# EAGLE design sesam_v2 (EAGLE 6.6.0)
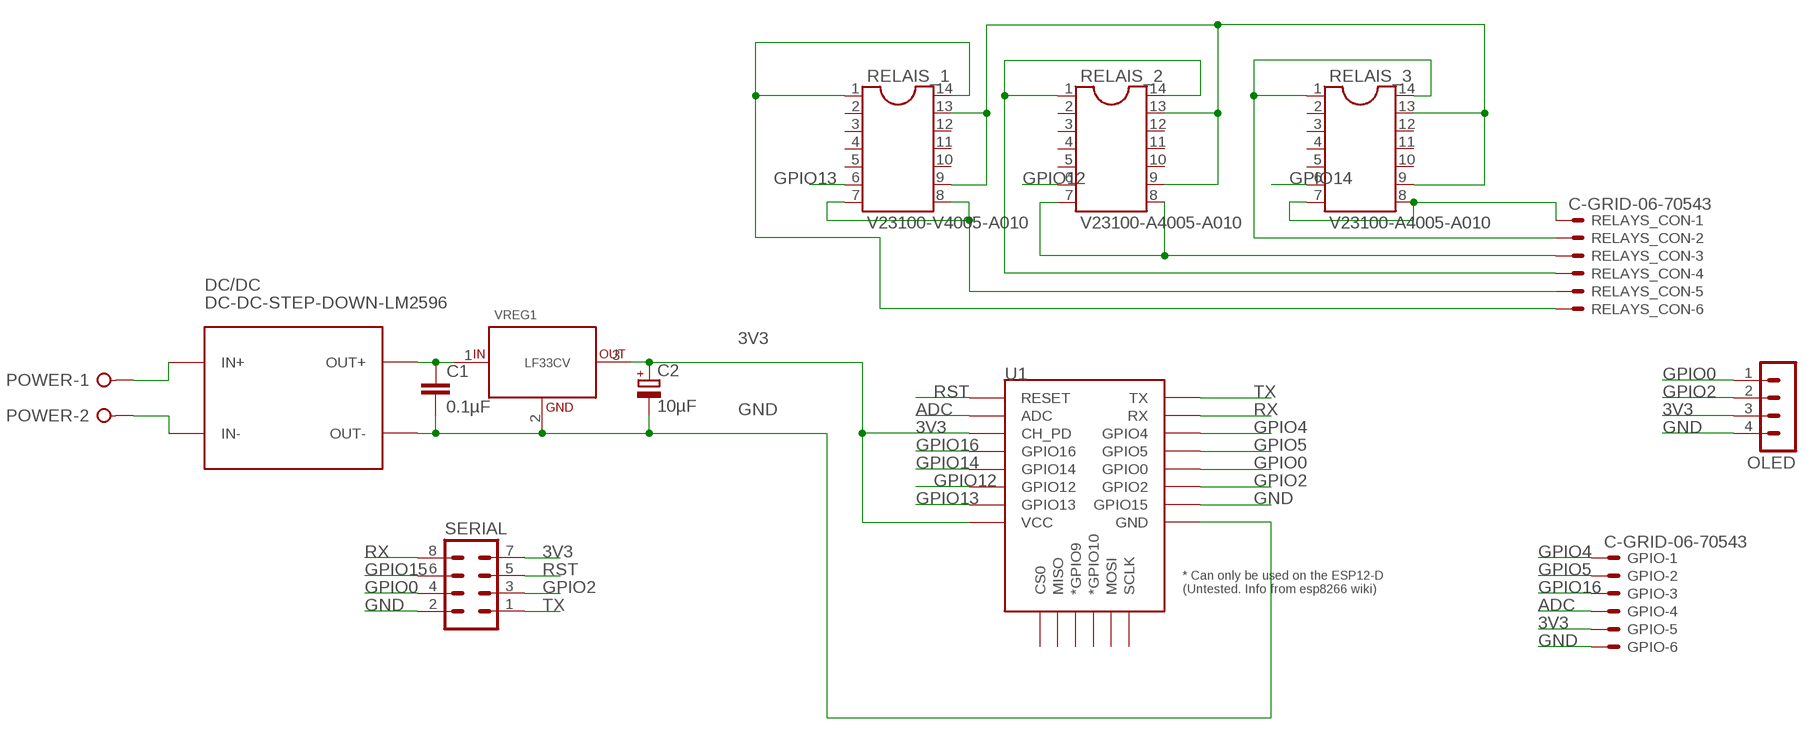
[diagram p0: schematic, sheet 1]

## Parts
C1  0.1µF  C-EUC0805  [C0805]
C2  10µF  CPOL-EUE2-5  [E2-5]
DC/DC  DC-DC-STEP-DOWN-LM2596  [DC-DC-STEP-DOWN-LM2596]
GPIO  C-GRID-06-70543  [70543-06]
OLED  MA04-1  [MA04-1]
POWER  W237-02P  [W237-132]
RELAIS_1  V23100-V4005-A010  DIL14S  [SOCKET-14]
RELAIS_2  V23100-A4005-A010  DIL14S  [SOCKET-14]
RELAIS_3  V23100-A4005-A010  DIL14S  [SOCKET-14]
RELAYS_CON  C-GRID-06-70543  [70543-06]
SERIAL  MA04-2  [MA04-2]
U1  ESP12ESMD  [ESP12E-SMD]
VREG1  LF33CV  [TO220]

## Nets
3V3: C2.+ GPIO.5 OLED.3 SERIAL.7 U1.CH_PD U1.VCC VREG1.3(OUT)
ADC: GPIO.4 U1.ADC
GND: C1.2 C2.- DC/DC.IN- DC/DC.OUT- GPIO.6 OLED.4 POWER.2 RELAIS_1.9 RELAIS_1.13 RELAIS_2.9 RELAIS_2.13 RELAIS_3.9 RELAIS_3.13 SERIAL.2 U1.GND U1.GPIO15 VREG1.2(GND)
GPIO0: OLED.1 SERIAL.4 U1.GPIO0
GPIO2: OLED.2 SERIAL.3 U1.GPIO2
GPIO4: GPIO.1 U1.GPIO4
GPIO5: GPIO.2 U1.GPIO5
GPIO12: RELAIS_2.6 U1.GPIO12
GPIO13: RELAIS_1.6 U1.GPIO13
GPIO14: RELAIS_3.6 U1.GPIO14
GPIO15: SERIAL.6
GPIO16: GPIO.3 U1.GPIO16
N$3: RELAIS_3.1 RELAIS_3.14 RELAYS_CON.2
N$4: DC/DC.IN+ POWER.1
N$5: RELAIS_3.7 RELAIS_3.8 RELAYS_CON.1
N$10: RELAIS_2.1 RELAIS_2.14 RELAYS_CON.4
N$13: RELAIS_2.7 RELAIS_2.8 RELAYS_CON.3
N$14: RELAIS_1.1 RELAIS_1.14 RELAYS_CON.6
N$15: RELAIS_1.7 RELAIS_1.8 RELAYS_CON.5
POWER: C1.1 DC/DC.OUT+ VREG1.1(IN)
RST: SERIAL.5 U1.RESET
RX: SERIAL.8 U1.RXD0(RX)
TX: SERIAL.1 U1.TXD0(TX)
Unconnected: RELAIS_1.2 RELAIS_1.3 RELAIS_1.4 RELAIS_1.5 RELAIS_1.10 RELAIS_1.11 RELAIS_1.12 RELAIS_2.2 RELAIS_2.3 RELAIS_2.4 RELAIS_2.5 RELAIS_2.10 RELAIS_2.11 RELAIS_2.12 RELAIS_3.2 RELAIS_3.3 RELAIS_3.4 RELAIS_3.5 RELAIS_3.10 RELAIS_3.11 RELAIS_3.12 U1.CS0 U1.GPIO9(*GPIO9) U1.GPIO10(*GPIO10) U1.MISO U1.MOSI U1.SCLK

## Library data of the parts
C1 = rcl:C-EU: CAPACITOR, European symbol
C2 = rcl:CPOL-EU: POLARIZED CAPACITOR, European symbol
DC/DC = diy-modules:DC-DC-STEP-DOWN-LM2596: DC/DC Step-Down Regulator based on LM2596-ADJ chip
GPIO RELAYS_CON = con-molex:C-GRID-06: CONNECTOR wire to board 2.54 mm (0.100") pitch header; OC_FARNELL: unknown; OC_NEWARK: unknown
OLED = con-lstb:MA04-1: PIN HEADER; OC_FARNELL: unknown; OC_NEWARK: unknown
POWER = con-wago-508:W237-02P: WAGO SREW CLAMP; OC_FARNELL: unknown; OC_NEWARK: unknown
RELAIS_1-RELAIS_3 = ic-package:DIL14: Dual In Line / Socket
SERIAL = con-lstb:MA04-2: PIN HEADER; OC_FARNELL: unknown; OC_NEWARK: unknown
U1 = esp8266modules:ESP12E: ESP12E Module
VREG1 = mp_vreg:LF33CV: LF33CV Low Drop 3.3V Voltage Regulator

## Board
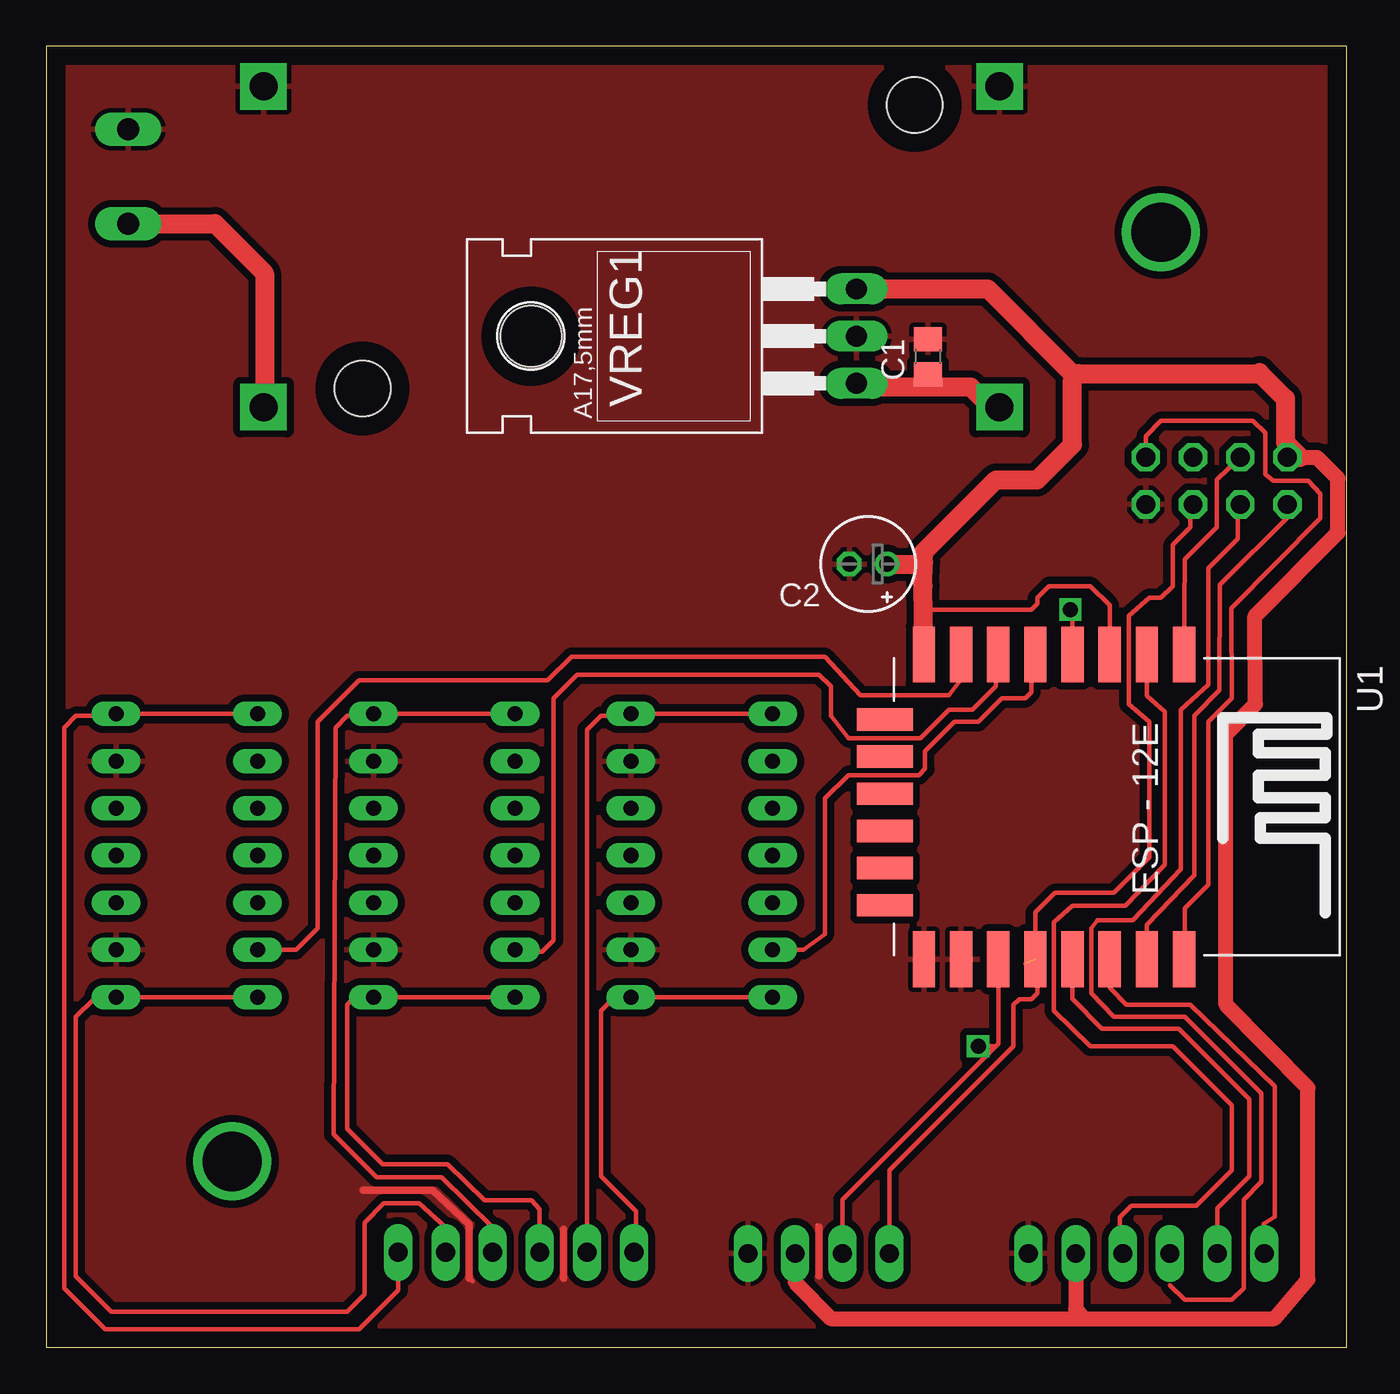
[diagram p1: board, top side]
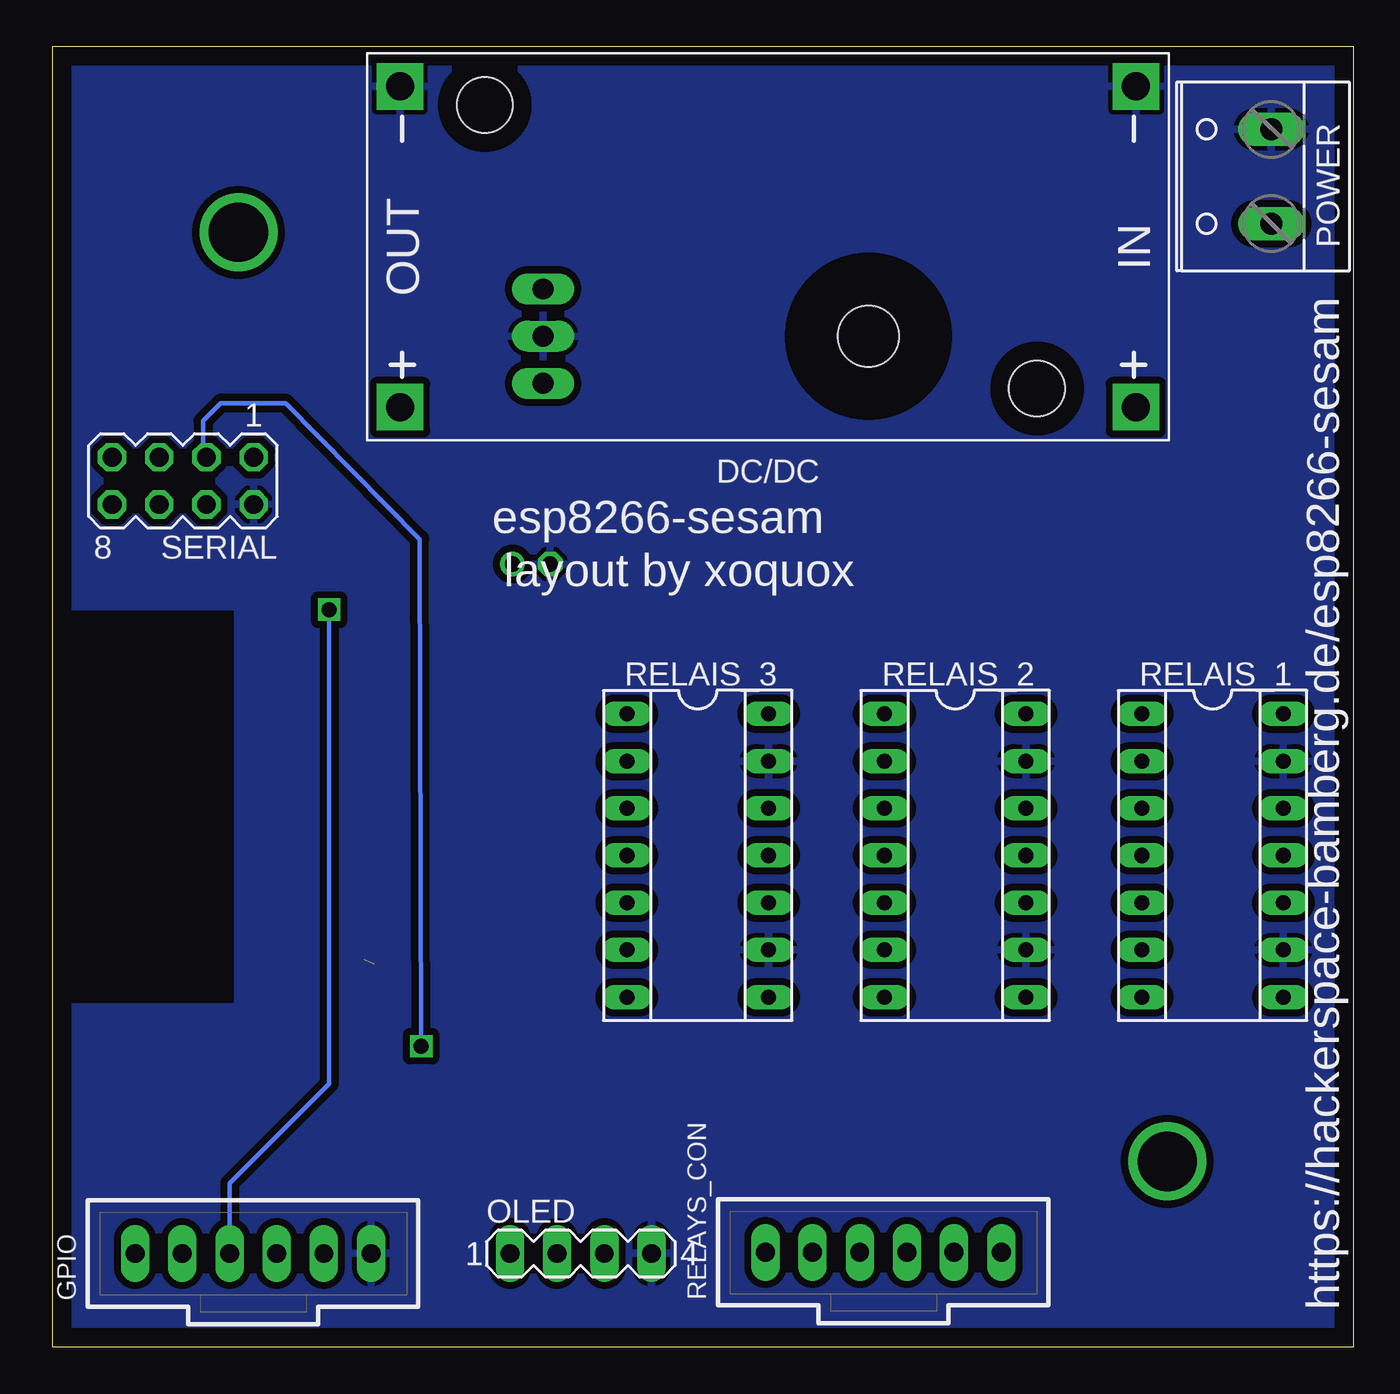
[diagram p2: board, bottom side, seen from below]

Size 70 x 70 mm. Coordinates in mm from the lower left corner, seen from the top.
Outline: 0,0 70,0 70,70 0,70 0,0
Copper layers (1*16): Top 0.035mm / dielectric 1.5mm / Bottom 0.035mm
Design rules "default *": minimum track width 10mil, minimum drill 24mil, track to track 15mil, track to pad 15mil, pad to pad 15mil, via to via 15mil, smd to smd 15mil, copper to edge 40mil, drill to drill 8mil, minimum pad ring 10mil, minimum via ring 8mil, stop-mask expansion 4mil, vias tented up to drill 0mil, thermal gap 10mil

### Footprints (pad centres in the part's own frame; a part is rotated, then mirrored left to right if it is on the bottom)
C0805 = smd 1.3 x 1.5: 1 -0.95,0; 2 0.95,0
E2-5 = drill 0.813 pad 1.27: + -1.016,0 | drill 0.813 pad 1.27 octagon: - 1.016,0
DC-DC-STEP-DOWN-LM2596 = drill 1.5 pad 2.5 square: IN+ -19.812,8.636; IN- -19.812,-8.636; OUT+ 19.812,8.636; OUT- 19.812,-8.636 | hole 3: -14.478,7.62; 15.24,-7.62
70543-06 = drill 1.016 long: 1 -6.35,0; 2 -3.81,0; 3 -1.27,0; 4 1.27,0; 5 3.81,0; 6 6.35,0
MA04-1 = drill 1.016 long: 1 -3.81,0; 2 -1.27,0; 3 1.27,0; 4 3.81,0
W237-132 = drill 1.194 long: 1 -2.54,-0.635; 2 2.54,-0.635
SOCKET-14 = drill 0.813 long: 1 -7.62,-3.81; 2 -5.08,-3.81; 3 -2.54,-3.81; 4 0,-3.81; 5 2.54,-3.81; 6 5.08,-3.81; 7 7.62,-3.81; 8 7.62,3.81; 9 5.08,3.81; 10 2.54,3.81; 11 0,3.81; 12 -2.54,3.81; 13 -5.08,3.81; 14 -7.62,3.81
MA04-2 = drill 1.016 octagon: 1 -3.81,-1.27; 2 -3.81,1.27; 3 -1.27,-1.27; 4 -1.27,1.27; 5 1.27,-1.27; 6 1.27,1.27; 7 3.81,-1.27; 8 3.81,1.27
ESP12E-SMD = smd 3 x 1.2: ADC -8.3,3.8; CH_PD -8.3,1.8; GND 8.1,-8.2; GPIO0 8.1,-2.2; GPIO2 8.1,-4.2; GPIO4 8.1,1.8; GPIO5 8.1,-0.2; GPIO12 -8.3,-4.2; GPIO13 -8.3,-6.2; GPIO14 -8.3,-2.2; GPIO15 8.1,-6.2; GPIO16 -8.3,-0.2; RESET -8.3,5.8; RXD0 8.1,3.8; TXD0 8.1,5.8; VCC -8.3,-8.2 | smd 1.2 x 3: CS0 -4.8,-10.3; GPIO9 -0.8,-10.3; GPIO10 1.2,-10.3; MISO -2.8,-10.3; MOSI 3.2,-10.3; SCLK 5.2,-10.3
TO220 = drill 1.118 long: 1 -2.54,-6.35; 2 0,-6.35; 3 2.54,-6.35 | hole 3.302: 0,11.176

### Placement (x,y rotation side)
C1  47.46,53.3 90 top
C2  44.24,42.15 180 top
DC/DC  31.5,59.22 180 bottom
GPIO  59.22,5.04 0 bottom
OLED  41.58,5.04 0 bottom
POWER  5.04,63 90 bottom
RELAIS_1  7.56,26.46 270 bottom
RELAIS_2  21.42,26.46 270 bottom
RELAIS_3  35.28,26.46 270 bottom
RELAYS_CON  25.29,5.1 0 bottom
SERIAL  63,46.62 180 bottom
U1  55.44,28.98 270 top
VREG1  37.26,54.41 90 top

### Tracks (layer width: path | path; a pad name or v marks a point on that pad's centre or on a via)
3V3
  Top 0.254: U1.CH_PD 57.24,39.91 56.2,40.96 53.98,40.96 53.34,40.32 53.34,40.01 53.02,39.69 47.54,39.69 47.21,39.36
  Top 0.813: OLED.3 40.31,3.5 42.23,1.54 55.88,1.54 | 55.88,1.54 66.11,1.54 67.91,3.64 67.91,13.96 63.5,18.44 63.5,32.99 65.09,34.61 65.06,39.34 69.53,43.83 69.53,46.76 68.4,47.89 67.5,47.89 SERIAL.7 | GPIO.5 55.41,2.06 55.88,1.54
  Top 1.016: U1.VCC 47.21,39.36 47.19,40.96 47.23,42.24 | 47.23,42.24 47.24,42.8 51.12,46.67 53.34,46.67 55.24,48.58 55.24,52.07 55.56,52.39 | 67.5,47.89 66.7,48.69 66.7,51.05 65.3,52.45 65.24,52.39 55.56,52.39 | C2.+ 47.13,42.15 47.23,42.24 | VREG1.3 50.68,56.95 55.24,52.39 55.56,52.39
ADC
  Top 0.254: U1.ADC 59.24,35.06 60.21,34.19 60.21,25.97 58.09,23.75 55.23,23.75 54.24,22.86 54.24,18.1 56.2,16.19 60.64,16.19 63.82,13.02 63.82,9.53 61.91,7.62 58.42,7.62 57.78,6.99 57.78,5.21 GPIO.4
GND
  Top 0.254: 22.75,3.7 22.95,3.55 | 41.6,6.45 41.5,6.55
  Top 0.406: 17.05,8.45 20.8,8.45 22.75,6.6 22.75,3.7 | 41.6,3.85 41.6,6.45 | 27.85,6.35 27.85,3.7
  pour Top: 0,70 70,70 70,40 60,40 60.12,18.48 70.12,18.48 70,0 0,0
  pour Bottom (isolate 0.305): 0,70 70,70 70.02,39.84 60.06,39.84 60.06,18.32 70.08,18.32 70.08,-0.12 0.06,-0.12 0.06,69.96
GPIO0  (1 unrouted)
  Top 0.254: OLED.1 45.39,9.51 52.07,16.19 52.07,18.41 52.39,18.73 53.02,18.73 53.34,19.05 53.34,20.78 U1.GPIO0 53.24,23.39 54.29,24.45 57.47,24.45 59.37,26.35 59.37,33.66 58.27,34.61 58.27,39.37 59.37,40.32 60.01,40.32 60.64,40.96 60.64,43.18 61.59,44.13 61.59,45.22 SERIAL.4 | 53.34,20 52.7,20.64
GPIO2  (via drill 0.8)
  Top 0.254: 51.12,16.19 42.86,7.94 42.86,5.05 OLED.2 | U1.GPIO2 51.24,16.32 51.12,16.19 | 51.12,16.19 v50.16,16.19
  Bottom 0.254: v50.16,16.19 50.25,43.48 57.47,50.8 60.96,50.8 61.91,49.85 61.91,48.07 SERIAL.3
GPIO4
  Top 0.254: U1.GPIO4 57.47,20.65 57.25,19.35 58.13,18.41 61.59,18.41 66.12,14.04 66.12,7.02 65.55,6.65 65.55,5.06 GPIO.1
GPIO5
  Top 0.254: U1.GPIO5 55.24,18.74 56.83,17.14 60.96,17.14 64.77,13.34 64.77,9.21 63.03,7.47 GPIO.2
GPIO12
  Top 0.254: RELAIS_2.6 25.34,21.27 26.67,21.27 27.3,21.91 27.3,34.92 28.57,36.2 41.59,36.2 42.23,35.56 42.23,33.97 43.18,32.77 47.06,32.77 48.58,34.29 49.85,34.29 51.12,35.56 51.12,37.16 U1.GPIO12
GPIO13
  Top 0.254: RELAIS_1.6 13.44,21.38 14.61,22.54 14.61,33.66 16.83,35.88 26.99,35.88 28.26,37.15 41.91,37.15 43.81,35.09 48.58,35.09 49.21,35.88 49.21,37.25 U1.GPIO13
GPIO14
  Top 0.254: RELAIS_3.6 40.75,21.38 41.91,22.23 41.91,29.53 43.18,30.78 46.97,30.78 47.31,31.11 47.31,32.07 48.9,33.66 50.16,33.66 51.44,34.92 52.7,34.92 53.02,35.24 53.02,37.06 U1.GPIO14
GPIO15
  Top 0.254: 60.49,3.33 61.28,2.54 63.82,2.54 64.45,3.17 64.45,7.94 65.41,8.89 65.41,13.65 61.28,17.78 57.47,17.78 56.25,19.05 56.25,22.54 56.58,22.98 58.49,22.98 61.08,25.72 61.08,34.29 62.55,35.66 62.55,41.91 64.14,43.5 64.14,45.22 SERIAL.6
GPIO16  (via drill 0.8 pad 0.25)
  Top 0.254: U1.GPIO16 55.24,39.89 v55.12,39.69
  Bottom 0.254: v55.12,39.69 55.12,14.18 60.48,8.82 GPIO.3
N$1  (via drill 3.2)
  other vias: 60,60
N$2  (via drill 3.2)
  other vias: 10,10
N$3
  Top 0.254: RELAYS_CON.2 29.1,33.23 29.84,33.97 30.8,33.97 | 30.8,33.97 31.36,33.97 RELAIS_3.14 | RELAIS_3.1 30.91,34.08 30.8,33.97
N$4
  Top 1.016: POWER.1 9.07,60.46 11.75,57.78 11.75,50.64 DC/DC.IN+
N$5
  Top 0.254: RELAIS_3.7 RELAIS_3.8 30.59,18.84 29.84,18.1 29.84,9.21 31.43,7.62 31.75,7.3 31.75,5.21 RELAYS_CON.1
N$10
  Top 0.254: RELAYS_CON.4 24.02,6.44 21.27,9.14 17.78,9.14 15.46,11.46 15.56,33.34 16.19,33.97 16.83,33.97 | 16.83,33.97 17.5,33.97 RELAIS_2.14 | RELAIS_2.1 16.93,34.08 16.83,33.97
N$13
  Top 0.254: RELAIS_2.7 RELAIS_2.8 17.4,19.05 16.83,19.05 16.19,18.41 16.19,11.75 18.1,9.84 21.59,9.84 23.58,7.91 26.12,7.91 26.56,7.41 RELAYS_CON.3
N$14
  Top 0.254: RELAYS_CON.6 18.94,3.06 16.84,0.95 3.17,0.95 0.95,3.17 0.95,33.34 1.59,33.97 3.64,33.97 RELAIS_1.14 RELAIS_1.1
N$15
  Top 0.254: RELAIS_1.7 4.45,18.84 | 4.45,18.84 RELAIS_1.8 | RELAYS_CON.5 21.48,6.46 20.05,7.74 18.14,7.74 17.14,6.68 17.14,2.85 16.19,1.91 3.49,1.91 1.59,3.81 1.59,17.78 2.54,18.73 4.34,18.73 4.45,18.84
POWER
  Top 1.016: DC/DC.OUT+ 50.85,50.58 49.77,51.66 47.56,51.66 | 47.56,51.66 43.82,51.66 VREG1.1 | C1.1 47.46,51.77 47.56,51.66
RST
  Top 0.254: U1.RESET 61.29,42.41 63.02,44.13 63.02,46.69 SERIAL.5
RX
  Top 0.254: U1.RXD0 59.24,22.73 61.81,25.4 61.81,33.97 63.13,35.34 63.18,41.03 66.9,44.75 66.9,45.26 SERIAL.8
TX
  Top 0.254: SERIAL.1 59.19,49.03 60.01,49.85 64.94,49.85 65.62,49.21 65.62,46.99 66.04,46.62 67.94,46.62 68.58,45.94 68.58,44.61 63.78,39.77 63.82,34.92 62.55,33.66 62.55,24.9 61.28,23.63 61.28,20.92 U1.TXD0

### Text on the board
bNames: https://hackerspace-bamberg.de/esp8266-sesam | esp8266-sesam | layout by xoquox